# Altium schematic sheet INFO.SchDoc
size A3; DocumentNumber: 2; SheetNumber: 2; SheetTotal: 19
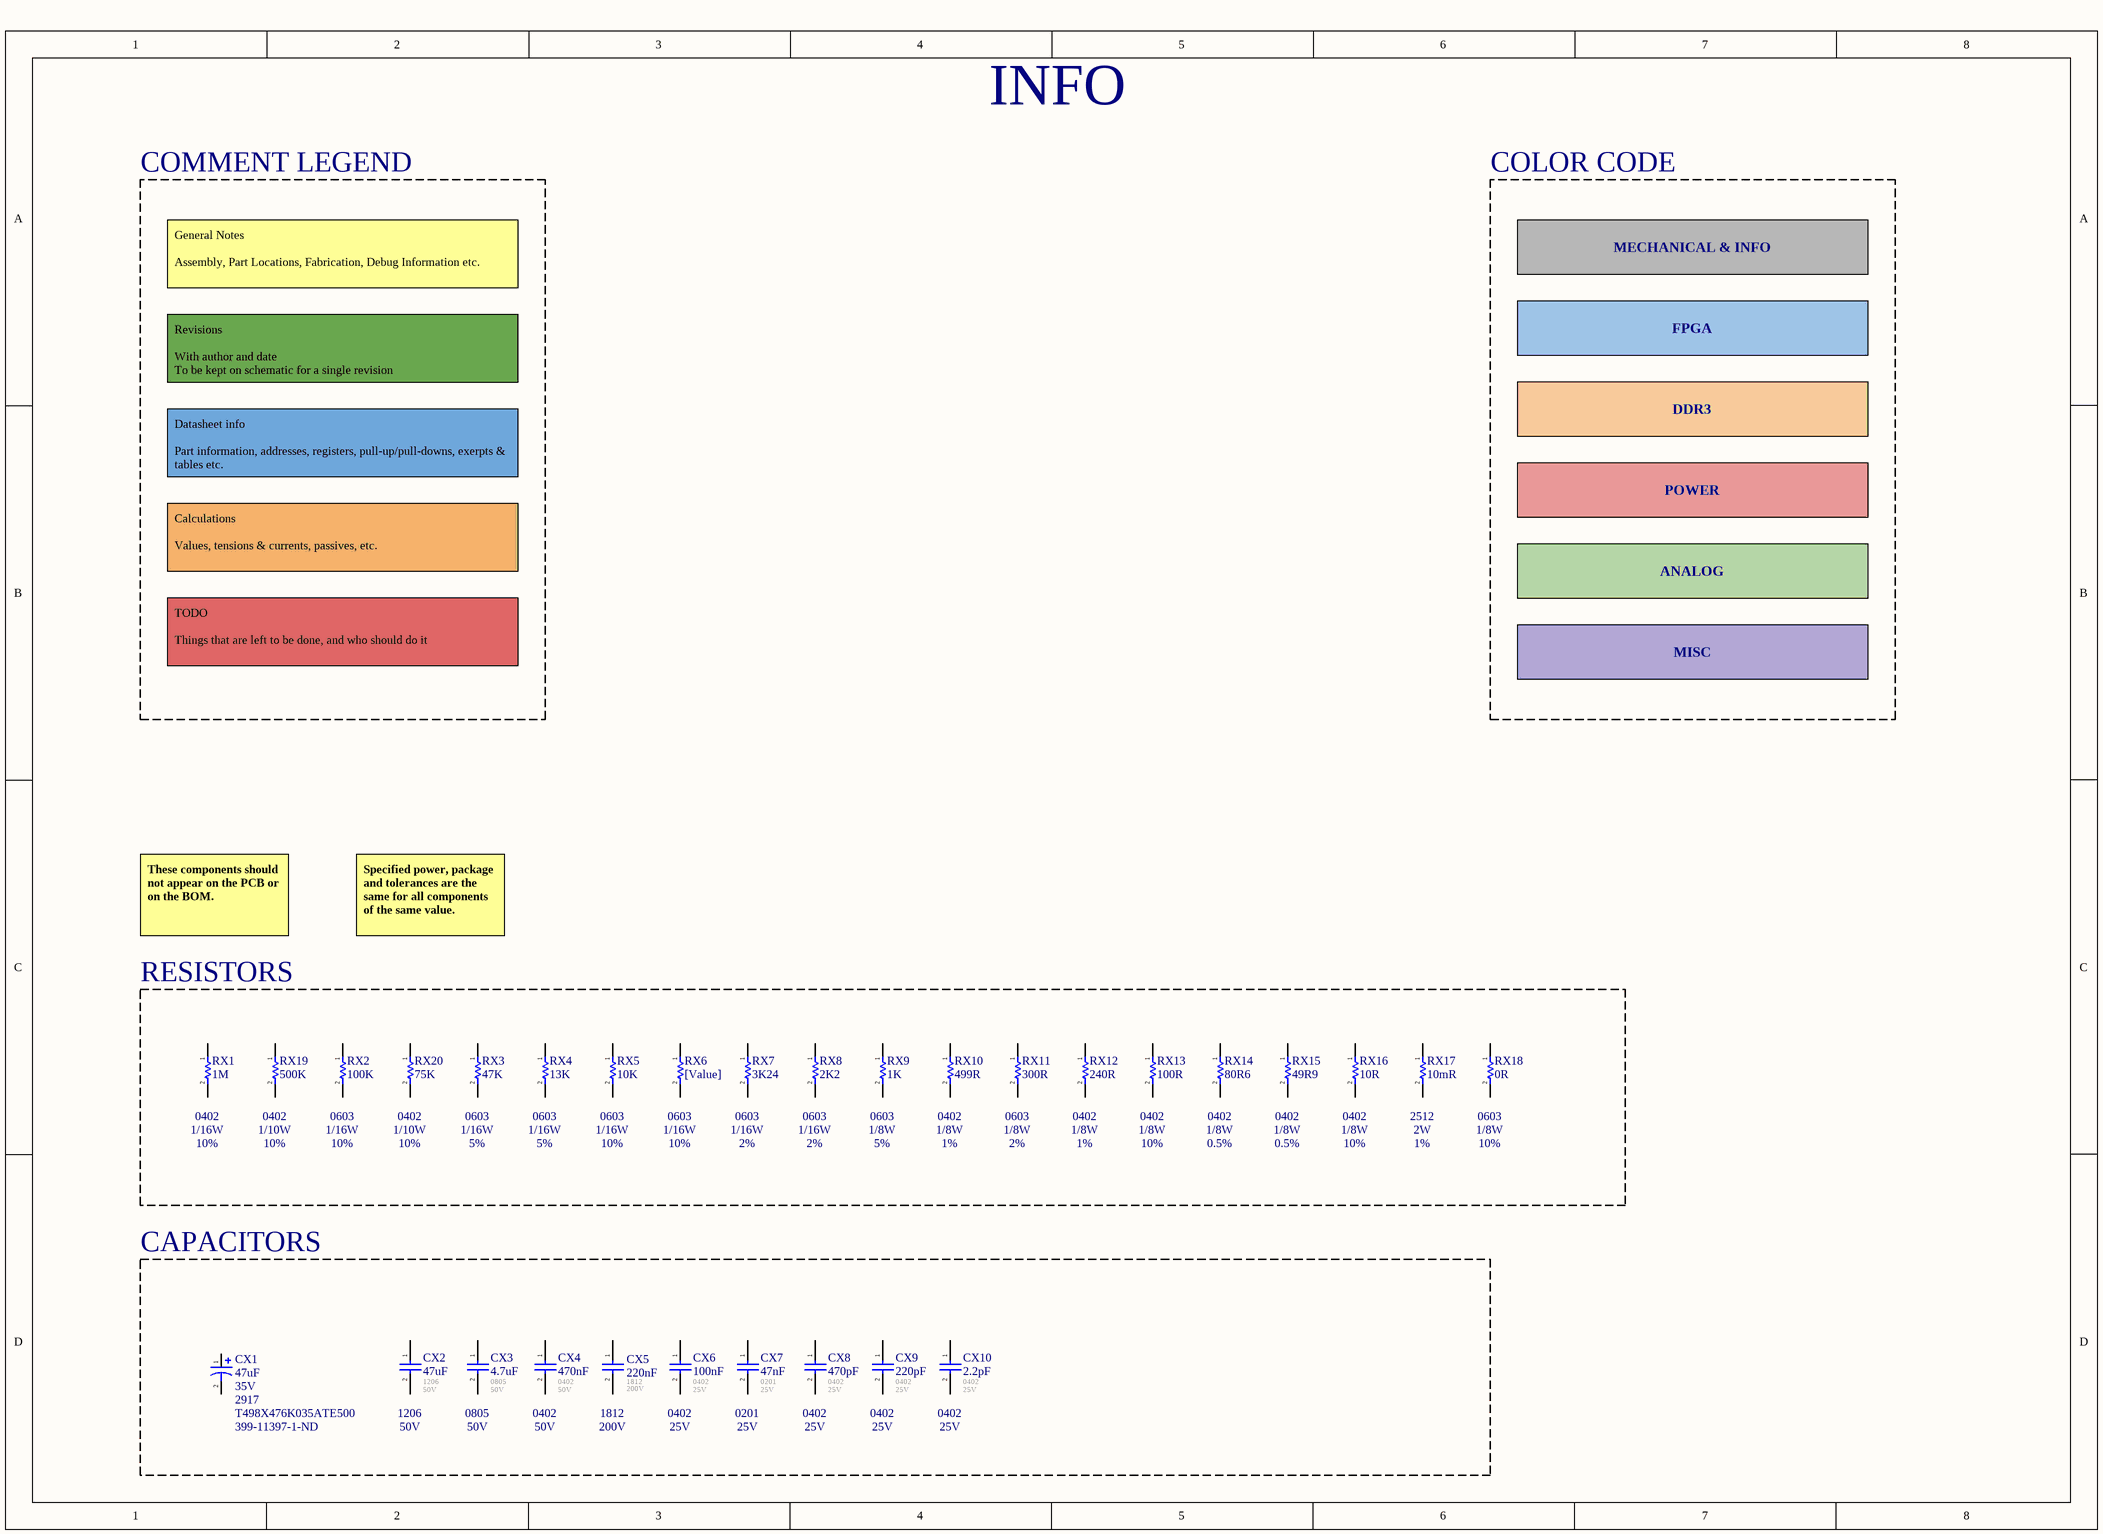
[diagram p0: INFO.SchDoc]

## Parts
CX1  47uF  Part #: T498X476K035ATE500  Rated Voltage: 35V  Supplier Part Number 1: 399-11397-1-ND  Package: 2917  [CAP_2917_P]
CX2  47uF  Footprint: 1206  Voltage - Rated: 50V  [CAP_1206]
CX3  4.7uF  Footprint: 0805  Voltage - Rated: 50V  [CAP_0805]
CX4  470nF  Footprint: 0402  Voltage - Rated: 50V  [CAP_0402]
CX5  220nF  Voltage - Rated: 200V  Footprint: 1812  [CAP_1812]
CX6  100nF  Footprint: 0402  Voltage - Rated: 25V  [CAP_0402]
CX7  47nF  Footprint: 0201  Voltage - Rated: 25V  [CAP_0201]
CX8  470pF  Footprint: 0402  Voltage - Rated: 25V  [CAP_0402]
CX9  220pF  Footprint: 0402  Voltage - Rated: 25V  [CAP_0402]
CX10  2.2pF  Footprint: 0402  Voltage - Rated: 25V  [CAP_0402]
RX1  1M  [RES_0402]
RX2  100K  [RES_0603]
RX3  47K  [RES_0603]
RX4  13K  [RES_0603]
RX5  10K  [RES_0603]
RX6  [Value]  [RES_0603]
RX7  3K24  [RES_0603]
RX8  2K2  [RES_0603]
RX9  1K  [RES_0603]
RX10  499R  [RES_0402]
RX11  300R  [RES_0603]
RX12  240R  [RES_0402]
RX13  100R  [RES_0402]
RX14  80R6  [RES_0402]
RX15  49R9  [RES_0402]
RX16  10R  [RES_0402]
RX17  10mR  [RES_2512]
RX18  0R  [RES_0603]
RX19  500K  [RES_0402]
RX20  75K  [RES_0402]

## Blocks framed on the sheet
RESISTORS: RX1-RX20
CAPACITORS: CX1-CX10

## Nets

Not connected (* = marked no-connect by the designer): CX1 1 2; CX2 1 2; CX3 1 2; CX4 1 2; CX5 1 2; CX6 1 2; CX7 1 2; CX8 1 2; CX9 1 2; CX10 1 2; RX1 1 2; RX2 1 2; RX3 1 2; RX4 1 2; RX5 1 2; RX6 1 2; RX7 1 2; RX8 1 2; RX9 1 2; RX10 1 2; RX11 1 2; RX12 1 2; RX13 1 2; RX14 1 2; RX15 1 2; RX16 1 2; RX17 1 2; RX18 1 2; RX19 1 2; RX20 1 2

## Notes on the sheet
- INFO
- COMMENT LEGEND
- COLOR CODE
- MECHANICAL & INFO
- General Notes
  Assembly, Part Locations, Fabrication, Debug Information etc.
- FPGA
- Revisions
  With author and date
  To be kept on schematic for a single revision
- DDR3
- Datasheet info
  Part information, addresses, registers, pull-up/pull-downs, exerpts & tables etc.
- POWER
- Calculations
  Values, tensions & currents, passives, etc.
- ANALOG
- TODO
  Things that are left to be done, and who should do it
- MISC
- These components should not appear on the PCB or on the BOM.
- Specified power, package and tolerances are the same for all components of the same value.
- (near RX1) 0402
- (near RX1) 1/16W
- 10%
- (near RX19) 0402
- (near RX19) 1/10W
- (near RX2) 0603
- (near RX2) 1/16W
- (near RX20) 0402
- (near RX20) 1/10W
- (near RX3) 0603
- (near RX3) 1/16W
- 5%
- (near RX4) 0603
- (near RX4) 1/16W
- (near RX5) 0603
- (near RX5) 1/16W
- (near RX6) 0603
- (near RX6) 1/16W
- (near RX7) 0603
- (near RX7) 1/16W
- 2%
- (near RX8) 0603
- (near RX8) 1/16W
- (near RX9) 0603
- (near RX9) 1/8W
- (near RX10) 0402
- (near RX10) 1/8W
- 1%
- (near RX11) 0603
- (near RX11) 1/8W
- (near RX12) 0402
- (near RX12) 1/8W
- (near RX13) 0402
- (near RX13) 1/8W
- (near RX14) 0402
- (near RX14) 1/8W
- 0.5%
- (near RX15) 0402
- (near RX15) 1/8W
- (near RX16) 0402
- (near RX16) 1/8W
- (near RX17) 2512
- (near RX17) 2W
- (near RX18) 0603
- (near RX18) 1/8W
- (near CX2) 1206
- (near CX3) 0805
- (near CX4) 0402
- (near CX5) 1812
- (near CX6) 0402
- (near CX7) 0201
- (near CX8) 0402
- (near CX9) 0402
- (near CX10) 0402
- (near CX2) 50V
- (near CX3) 50V
- (near CX4) 50V
- (near CX5) 200V
- (near CX6) 25V
- (near CX7) 25V
- (near CX8) 25V
- (near CX9) 25V
- (near CX10) 25V

## Library data of the parts
CX1 = CAP_T498X476K035ATE500: 47 µF Molded Tantalum Capacitors 35 V 2917 (7343 Metric) 500mOhm; Mfr: KEMET; Tolerance: 10%; Operating Temperature: -55C - 150C; Supplier 1: Digi-Key
CX2-CX10 = CAP_CER: Generic SMT Ceramic Capacitor; Operating Temperature: *; Tolerance: *; Mfr: *; ComponentLink1Description: Digikey; ComponentLink1URL: [Digikey Link]; Digikey Part No: *; ComponentLink2Description: Datasheet; ComponentLink2URL: [Datasheet Link]
RX1 RX2 RX5 = RESISTOR: Power: 1/16W; Tolerance: 10%; Automotive: *; Operating Temperature: *; # Digikey: *; ComponentLink1Description: Digikey; ComponentLink1URL: *; # Manufacturer: *; Package / Case: 0603
RX3 RX9 = RESISTOR: Power: 1/8W; Tolerance: 5%; Automotive: *; Operating Temperature: *; # Digikey: *; ComponentLink1Description: Digikey; ComponentLink1URL: *; # Manufacturer: *; Package / Case: 0603
RX4 = RESISTOR: Power: 1/16W; Tolerance: 5%; Automotive: *; Operating Temperature: *; # Digikey: *; ComponentLink1Description: Digikey; ComponentLink1URL: *; # Manufacturer: *; Package / Case: 0603
RX6 = RESISTOR: Power: [Power]; Tolerance: [Tolerance]; Automotive: *; Operating Temperature: *; # Digikey: *; ComponentLink1Description: Digikey; ComponentLink1URL: *; # Manufacturer: *; Package / Case: [Package]
RX7 RX8 = RESISTOR: Power: 1/16W; Tolerance: 2%; Automotive: *; Operating Temperature: *; # Digikey: *; ComponentLink1Description: Digikey; ComponentLink1URL: *; # Manufacturer: *; Package / Case: 0603
RX10 RX12 = RESISTOR: Power: 1/8W; Tolerance: 1%; Automotive: *; Operating Temperature: *; # Digikey: *; ComponentLink1Description: Digikey; ComponentLink1URL: *; # Manufacturer: *; Package / Case: 0402
RX11 = RESISTOR: Power: 1/8W; Tolerance: 2%; Automotive: *; Operating Temperature: *; # Digikey: *; ComponentLink1Description: Digikey; ComponentLink1URL: *; # Manufacturer: *; Package / Case: 0603
RX13 RX16 RX18 = RESISTOR: Power: 1/8W; Tolerance: 10%; Automotive: *; Operating Temperature: *; # Digikey: *; ComponentLink1Description: Digikey; ComponentLink1URL: *; # Manufacturer: *
  RX13 RX16: Package / Case: 0402
  RX18: Package / Case: 0603
RX14 RX15 = RESISTOR: Power: 1/8W; Tolerance: 0.5%; Automotive: *; Operating Temperature: *; Package / Case: 0402; # Digikey: *; ComponentLink1Description: Digikey; ComponentLink1URL: *; # Manufacturer: *
RX17 = RESISTOR: Power: 2W; Tolerance: 1%; Automotive: *; Operating Temperature: *; # Digikey: *; ComponentLink1Description: Digikey; ComponentLink1URL: *; # Manufacturer: *; Package / Case: 2512
RX19 RX20 = RESISTOR: Power: 1/10W; Tolerance: 10%; Automotive: *; Operating Temperature: *; # Digikey: *; ComponentLink1Description: Digikey; ComponentLink1URL: *; # Manufacturer: *; Package / Case: 0402